# EAGLE schematic [Rev0.1] Avionics (EAGLE 8.3.2)

## Sheet 1 of 6: GPS MODULE
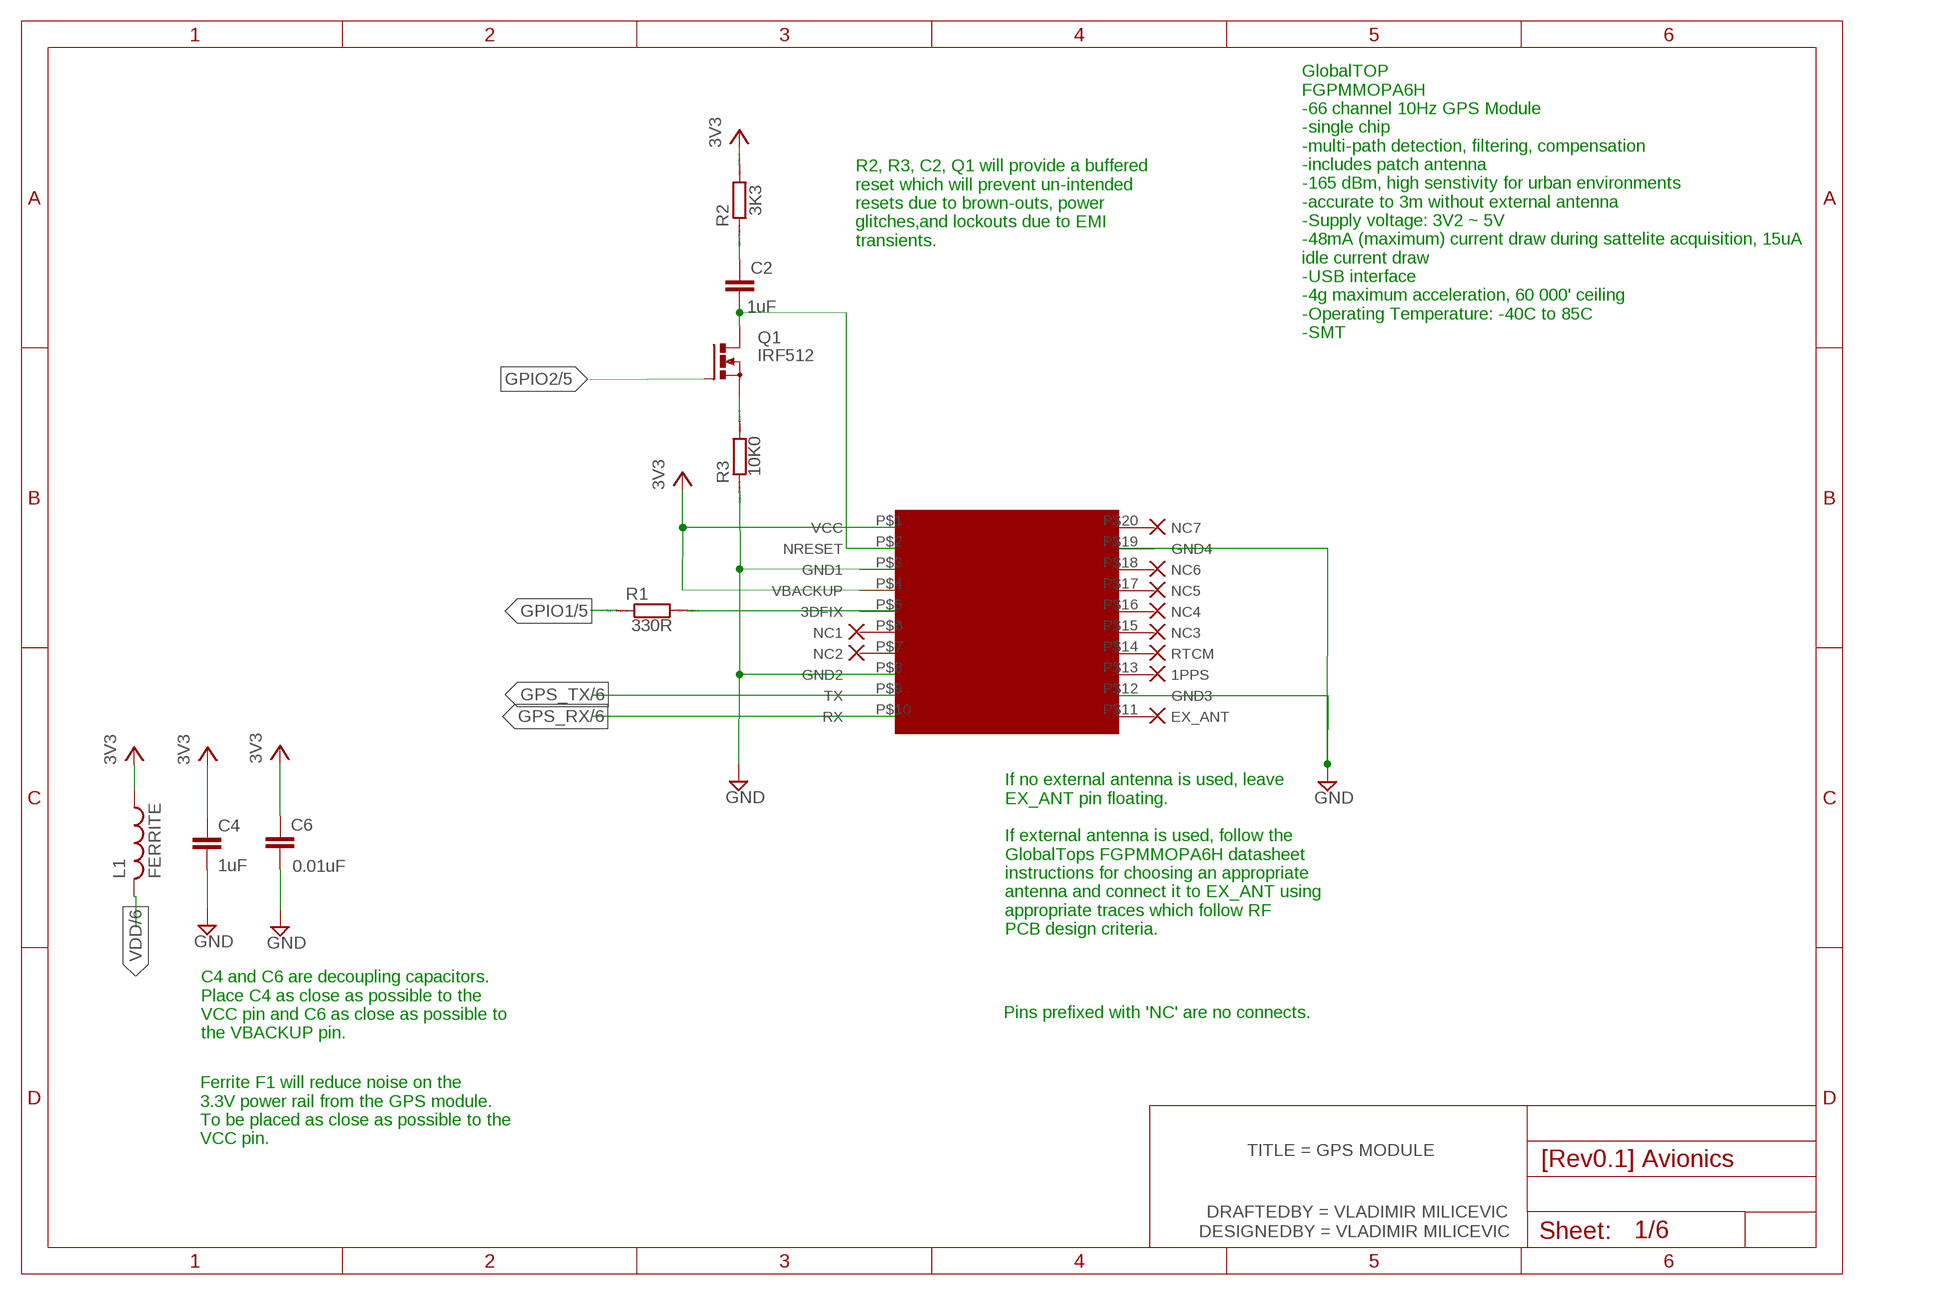
[diagram p0: schematic, sheet 1]
FRAME1 (A4L-LOC): DESIGNEDBY: VLADIMIR MILICEVIC; DRAFTEDBY: VLADIMIR MILICEVIC; TITLE: GPS MODULE

### Parts
C2  C2.5/2  [C2.5-2]
C4  C2.5/2  [C2.5-2]
C6  C2.5/2  [C2.5-2]
L1  FERRITE  L-USTFI0510  [TFI0510]
Q1  IRF512  [TO220BV]
R1  RR0603  [R0603]
R2  RR0402  [R0402]
R3  RR0402  [R0402]
U$1  GLOBALTOP-FPGMMOPAGHSMD_DIP20  [GLOBALTOP-FGPMMOPAGH]

### Nets
GND: C4.2 C6.2 U$1.P$8(GND2) U$1.P$12(GND3) U$1.P$19(GND4) ; also sheet 3,4,5,6
GPIO1: R1.1 ; also sheet 5,6
GPIO2: Q1.G ; also sheet 5,6
GPS_RX: U$1.P$10(RX) ; also sheet 6
GPS_TX: U$1.P$9(TX) ; also sheet 6
N$1: R1.2 U$1.P$5(3DFIX)
N$2: U$1.P$3(GND1)
N$3: Q1.S R3.2
N$4: R3.1
N$5: C2.2 Q1.D U$1.P$2(NRESET)
N$6: C2.1 R2.1
VCC: C4.1 C6.1 L1.1 R2.2 U$1.P$1(VCC) U$1.P$4(VBACKUP) ; supply symbol labelled 3V3 ; also sheet 3,4,5,6
VDD: L1.2 ; also sheet 5,6
Unconnected: U$1.P$6(NC1) U$1.P$7(NC2) U$1.P$11(EX_ANT) U$1.P$13(1PPS) U$1.P$14(RTCM) U$1.P$15(NC3) U$1.P$16(NC4) U$1.P$17(NC5) U$1.P$18(NC6) U$1.P$20(NC7)

### Notes on the sheet
- R2, R3, C2, Q1 will provide a buffered
  reset which will prevent un-intended
  resets due to brown-outs, power
  glitches,and lockouts due to EMI
  transients.
- GlobalTOP 
  FGPMMOPA6H
  -66 channel 10Hz GPS Module
  -single chip
  -multi-path detection, filtering, compensation
  -includes patch antenna 
  -165 dBm, high senstivity for urban environments
  -accurate to 3m without external antenna
  -Supply voltage: 3V2 ~ 5V
  -48mA (maximum) current draw during sattelite acquisition, 15uA 
  idle current draw
  -USB interface
  -4g maximum acceleration, 60 000' ceiling
  -Operating Temperature: -40C to 85C 
  -SMT
- If no external antenna is used, leave
  EX_ANT pin floating.
  
  If external antenna is used, follow the
  GlobalTops FGPMMOPA6H datasheet
  instructions for choosing an appropriate
  antenna and connect it to EX_ANT using
  appropriate traces which follow RF
  PCB design criteria.
- Pins prefixed with 'NC' are no connects.
- C4 and C6 are decoupling capacitors.
  Place C4 as close as possible to the
  VCC pin and C6 as close as possible to
  the VBACKUP pin.
- Ferrite F1 will reduce noise on the 
  3.3V power rail from the GPS module.
  To be placed as close as possible to the 
  VCC pin.

## Sheet 2 of 6: INPUT POWER REGULATION
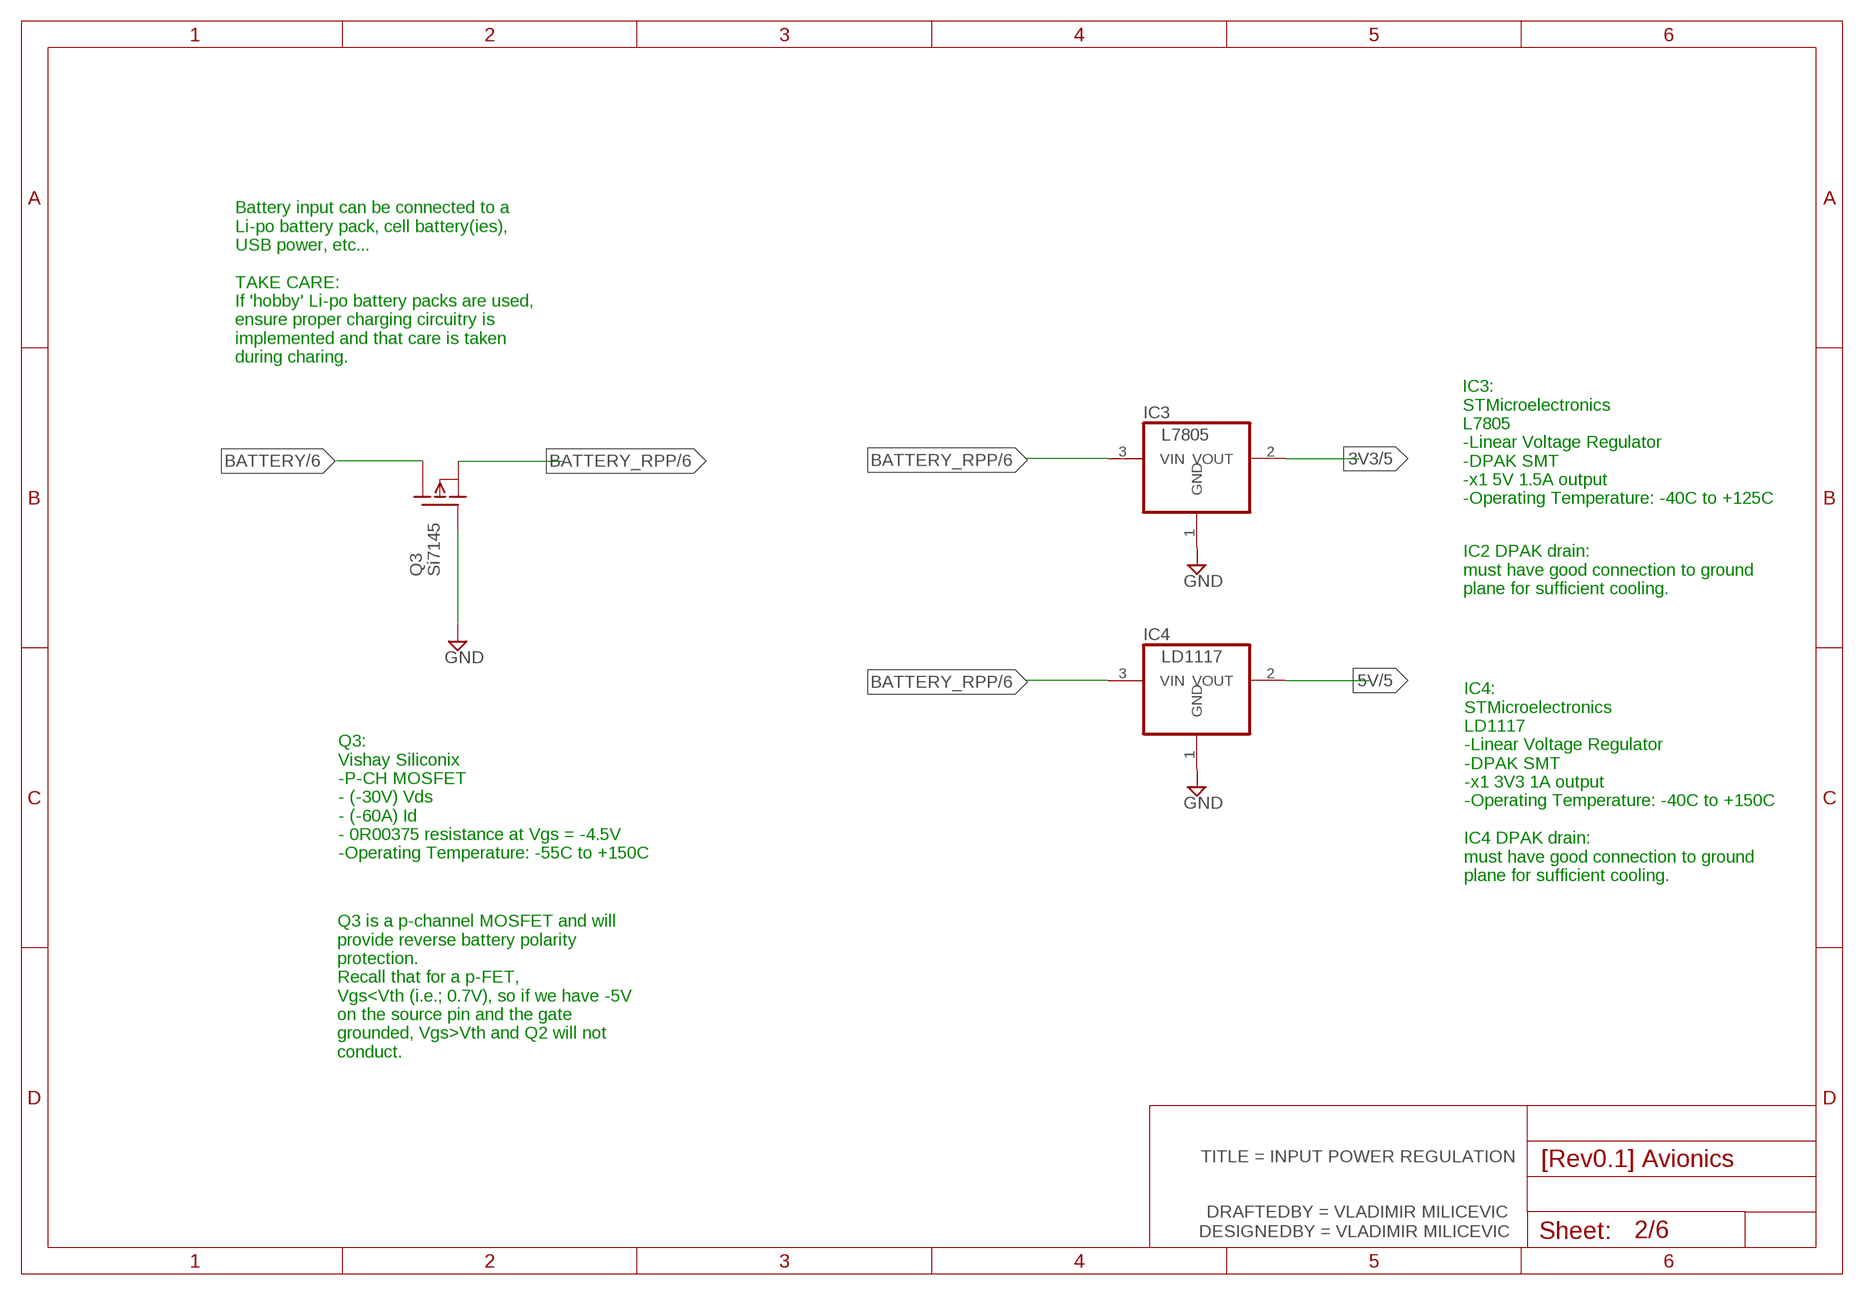
[diagram p1: schematic, sheet 2]
FRAME2 (A4L-LOC): DESIGNEDBY: VLADIMIR MILICEVIC; DRAFTEDBY: VLADIMIR MILICEVIC; TITLE: INPUT POWER REGULATION

### Parts
IC3  L7805  REG1117F  [DD-3]
IC4  LD1117  REG1117F  [DD-3]
Q3  Si7145  IRFD9210  [DIL04]

### Nets
3V3: IC3.2(VOUT) ; also sheet 5,6
5V: IC4.2(VOUT) ; also sheet 5,6
BATTERY: Q3.3(D) Q3.4(D) ; also sheet 6
BATTERY_RPP: IC3.3(VIN) IC4.3(VIN) Q3.2(S) ; also sheet 6
N$25: Q3.1(G)

### Notes on the sheet
- Battery input can be connected to a 
  Li-po battery pack, cell battery(ies),
  USB power, etc... 
  
  TAKE CARE:
  If 'hobby' Li-po battery packs are used,
  ensure proper charging circuitry is 
  implemented and that care is taken 
  during charing.
- IC3:
  STMicroelectronics
  L7805
  -Linear Voltage Regulator
  -DPAK SMT
  -x1 5V 1.5A output
  -Operating Temperature: -40C to +125C
- IC2 DPAK drain: 
  must have good connection to ground
  plane for sufficient cooling.
- IC4:
  STMicroelectronics
  LD1117
  -Linear Voltage Regulator
  -DPAK SMT
  -x1 3V3 1A output
  -Operating Temperature: -40C to +150C
- Q3:
  Vishay Siliconix
  -P-CH MOSFET
  - (-30V) Vds
  - (-60A) Id
  - 0R00375 resistance at Vgs = -4.5V
  -Operating Temperature: -55C to +150C
- IC4 DPAK drain:
  must have good connection to ground
  plane for sufficient cooling.
- Q3 is a p-channel MOSFET and will
  provide reverse battery polarity 
  protection. 
  Recall that for a p-FET, 
  Vgs<Vth (i.e.; 0.7V), so if we have -5V 
  on the source pin and the gate
  grounded, Vgs>Vth and Q2 will not 
  conduct.

## Sheet 3 of 6: ACCELEROMETER
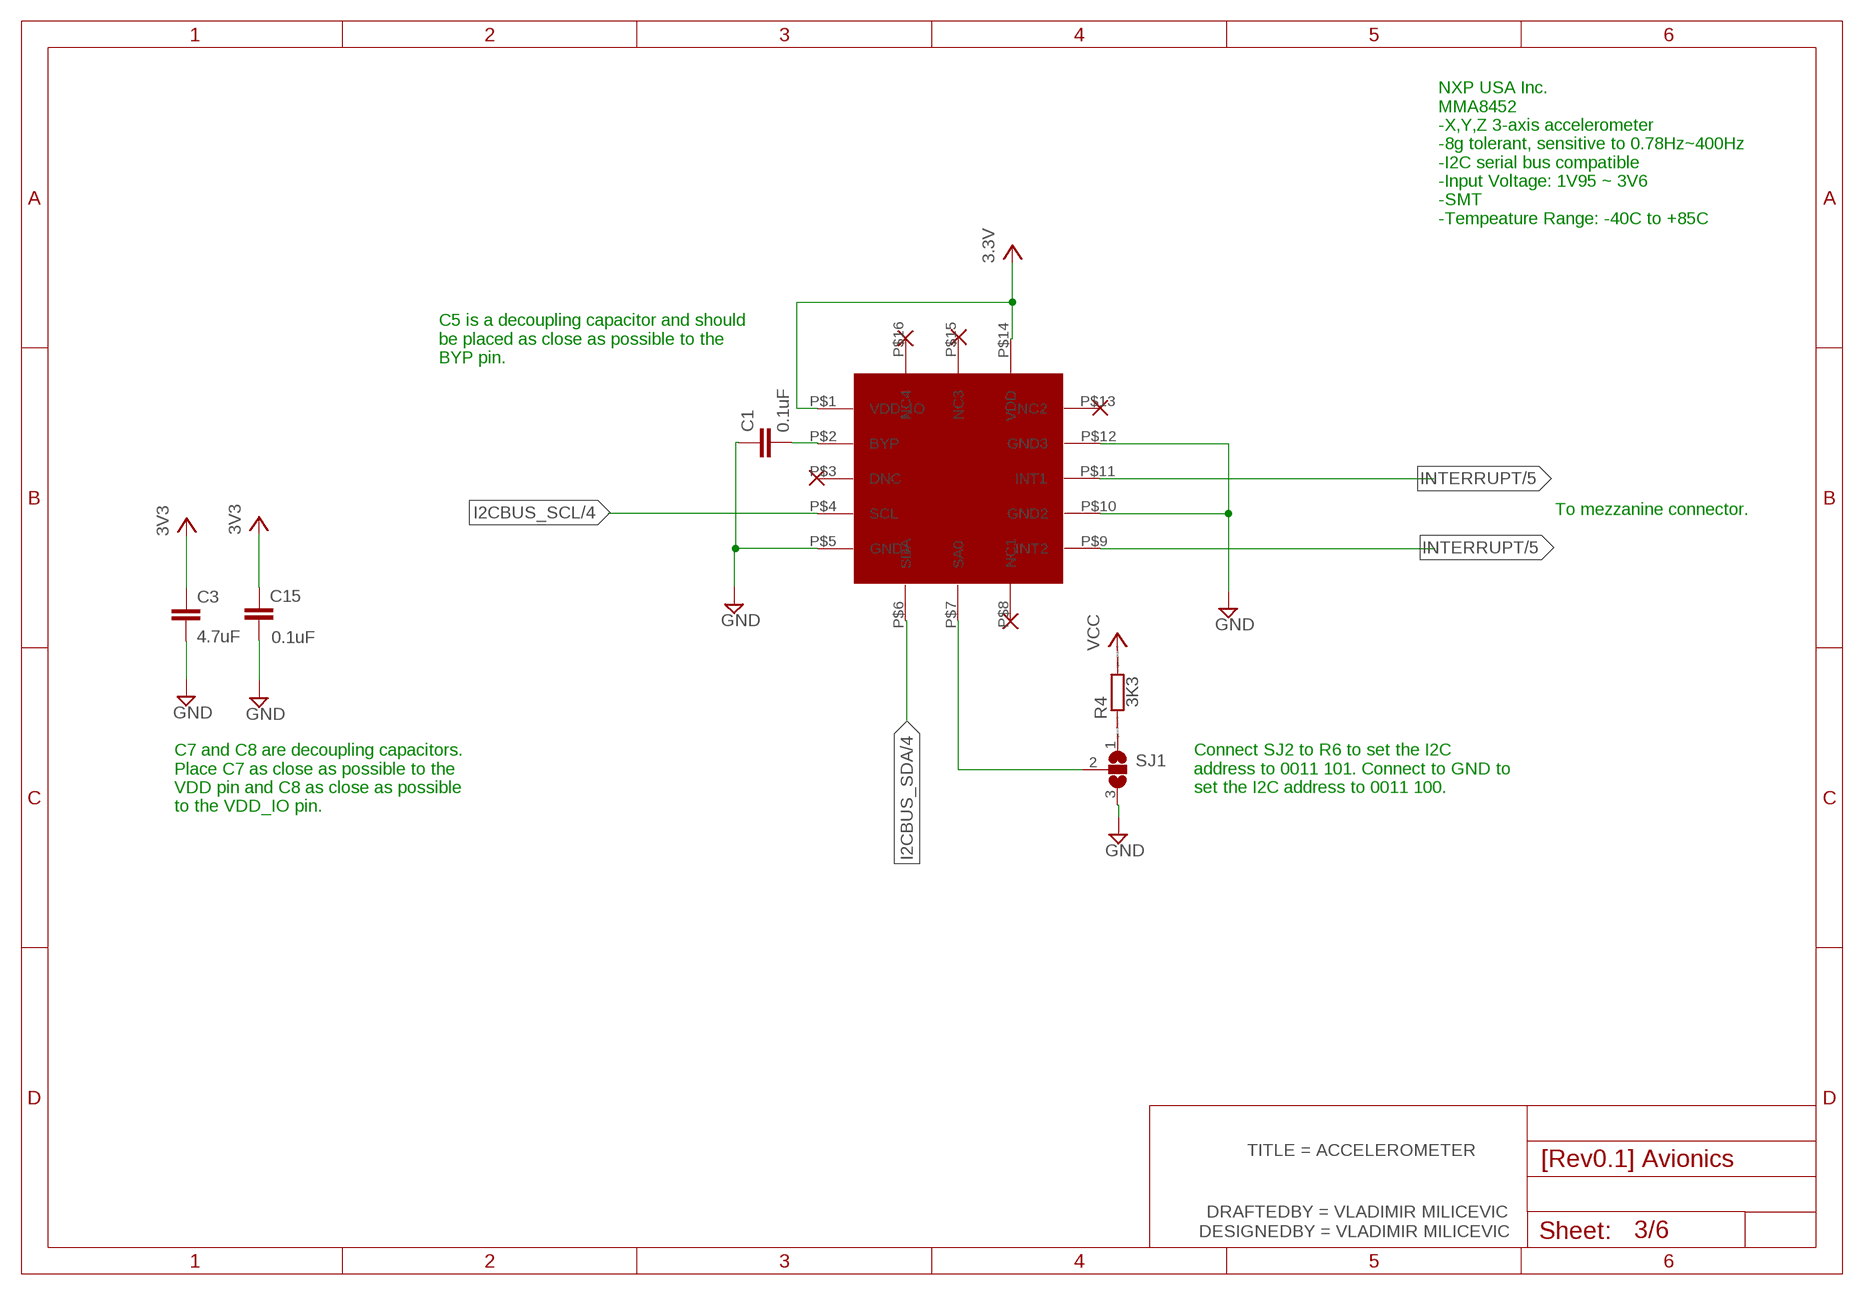
[diagram p2: schematic, sheet 3]
FRAME3 (A4L-LOC): DESIGNEDBY: VLADIMIR MILICEVIC; DRAFTEDBY: VLADIMIR MILICEVIC; TITLE: ACCELEROMETER

### Parts
C1  C2.5/4  [C2.5-4]
C3  C2.5/2  [C2.5-2]
C15  C2.5/2  [C2.5-2]
R4  RR0402  [R0402]
SJ1  SJ2WW  [SJ_2W]
U$2  MMA8452QQFN-16  [MMA8452Q]

### Nets
GND: C1.1 C3.2 C15.2 SJ1.3 U$2.P$5(GND1) U$2.P$10(GND2) U$2.P$12(GND3) ; also sheet 1,4,5,6
I2CBUS_SCL: U$2.P$4(SCL) ; also sheet 4,5,6
I2CBUS_SDA: U$2.P$6(SDA) ; also sheet 4,5,6
INTERRUPT: U$2.P$9(INT2) U$2.P$11(INT1) ; also sheet 5,6
N$7: C1.2 U$2.P$2(BYP)
N$8: SJ1.2 U$2.P$7(SA0)
VCC: C3.1 C15.1 U$2.P$1(VDD_IO) U$2.P$14(VDD) ; supply symbol labelled 3.3V, 3V3 ; also sheet 1,4,5,6
Unconnected: R4.1 R4.2 SJ1.1 U$2.P$3(DNC) U$2.P$8(NC1) U$2.P$13(NC2) U$2.P$15(NC3) U$2.P$16(NC4)

### Notes on the sheet
- NXP USA Inc. 
  MMA8452
  -X,Y,Z 3-axis accelerometer
  -8g tolerant, sensitive to 0.78Hz~400Hz
  -I2C serial bus compatible
  -Input Voltage: 1V95 ~ 3V6
  -SMT
  -Tempeature Range: -40C to +85C
- C5 is a decoupling capacitor and should
  be placed as close as possible to the 
  BYP pin.
- To mezzanine connector.
- Connect SJ2 to R6 to set the I2C
  address to 0011 101. Connect to GND to
  set the I2C address to 0011 100.
- C7 and C8 are decoupling capacitors.
  Place C7 as close as possible to the
  VDD pin and C8 as close as possible
  to the VDD_IO pin.

## Sheet 4 of 6: BAROMETER
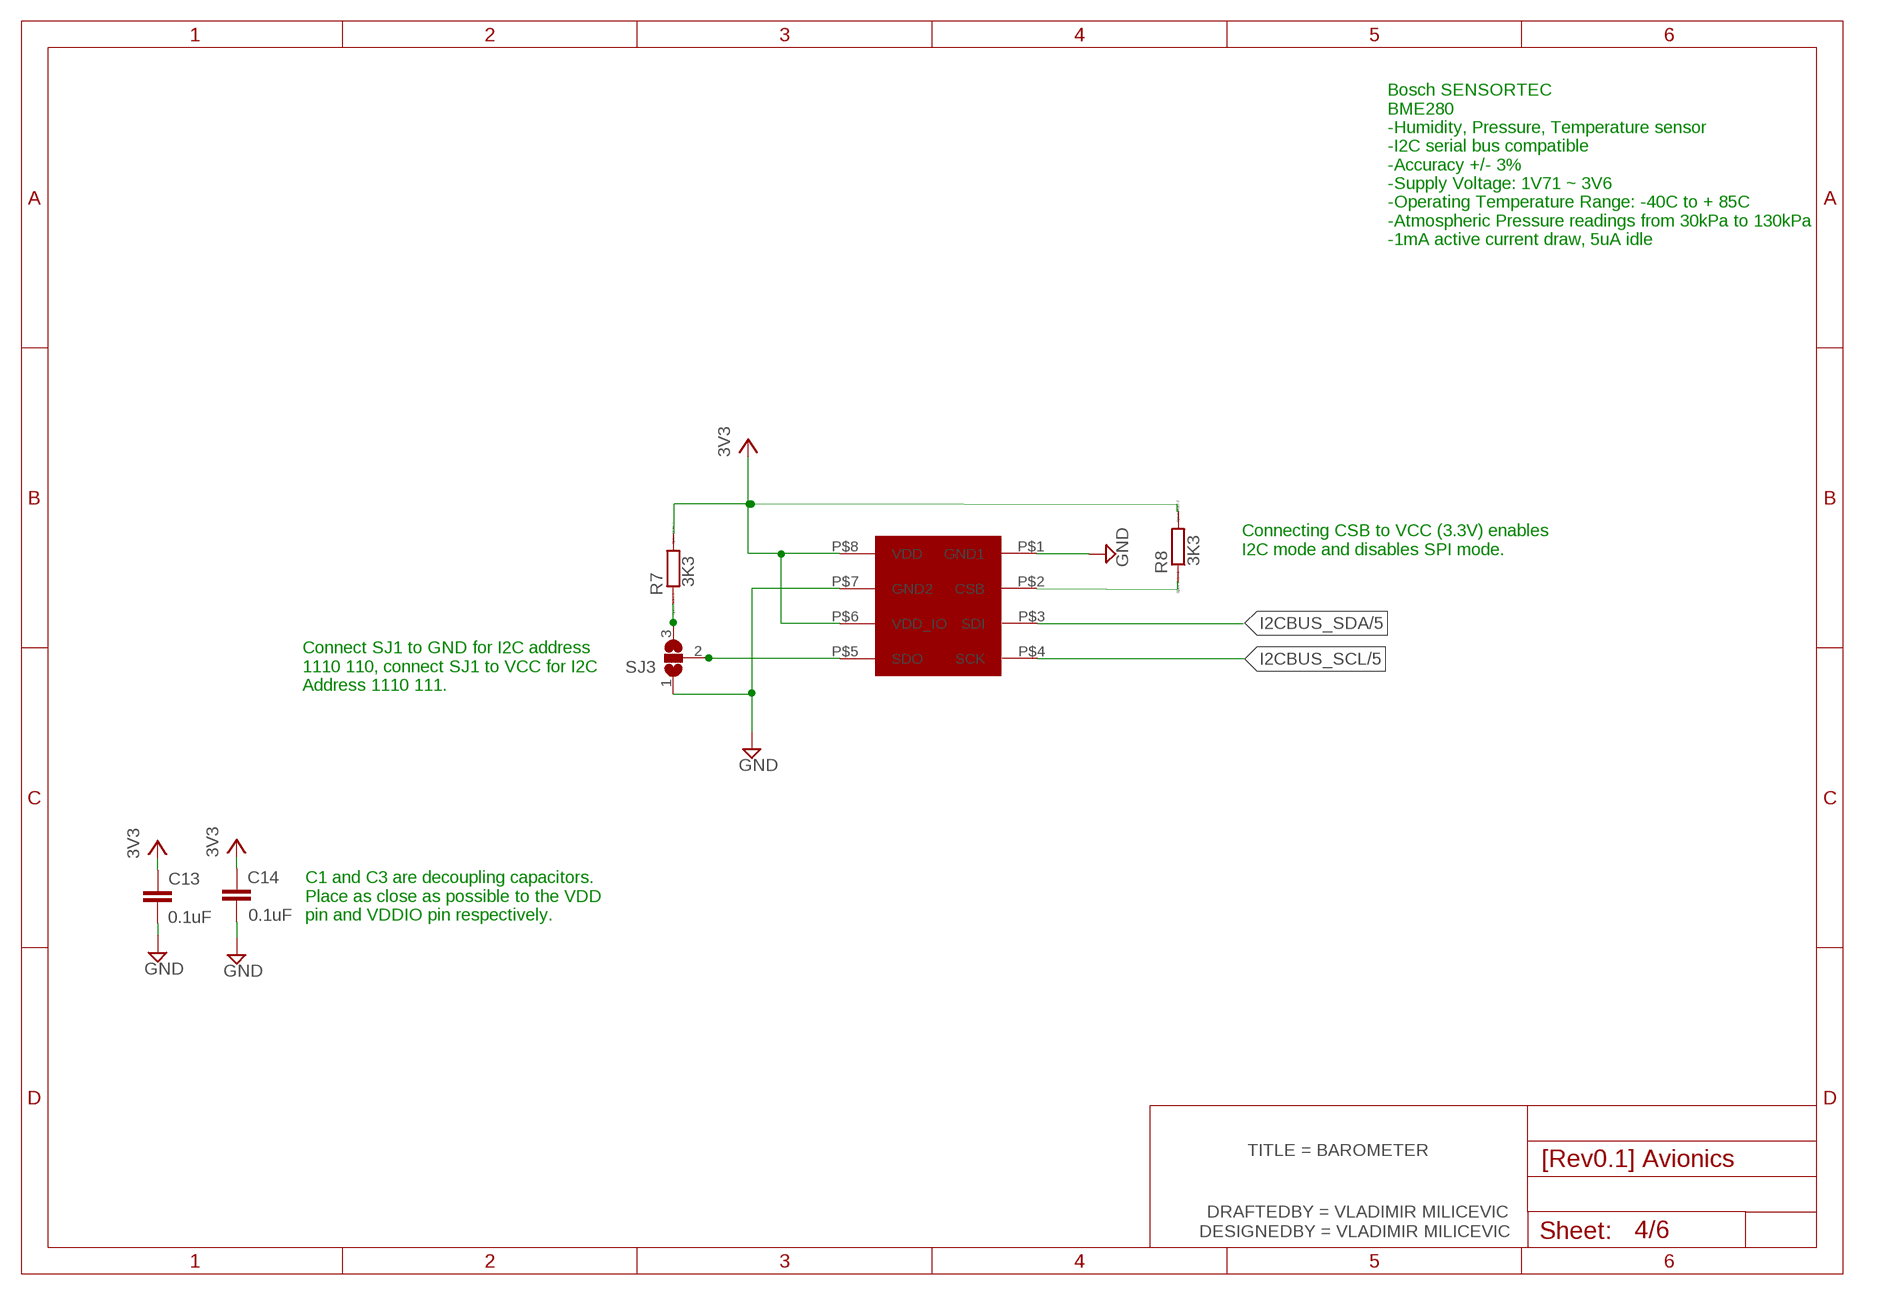
[diagram p3: schematic, sheet 4]
FRAME4 (A4L-LOC): DESIGNEDBY: VLADIMIR MILICEVIC; DRAFTEDBY: VLADIMIR MILICEVIC; TITLE: BAROMETER

### Parts
C13  C2.5/4  [C2.5-4]
C14  C2.5/4  [C2.5-4]
R7  RR0402  [R0402]
R8  RR0402  [R0402]
SJ3  SJ2WW  [SJ_2W]
U$5  BME280DIP-8  [BME280]

### Nets
GND: C13.2 C14.2 SJ3.1 U$5.P$1(GND1) U$5.P$7(GND2) ; also sheet 1,3,5,6
I2CBUS_SCL: U$5.P$4(SCK) ; also sheet 3,5,6
I2CBUS_SDA: U$5.P$3(SDI) ; also sheet 3,5,6
N$19: R7.2
N$30: SJ3.2 U$5.P$5(SDO)
N$31: R7.1 SJ3.3
N$32: U$5.P$6(VDD_IO)
N$33: U$5.P$2(CSB)
N$34: R8.1
N$35: R8.2
VCC: C13.1 C14.1 U$5.P$8(VDD) ; supply symbol labelled 3V3 ; also sheet 1,3,5,6

### Notes on the sheet
- Bosch SENSORTEC
  BME280
  -Humidity, Pressure, Temperature sensor
  -I2C serial bus compatible
  -Accuracy +/- 3%
  -Supply Voltage: 1V71 ~ 3V6
  -Operating Temperature Range: -40C to + 85C
  -Atmospheric Pressure readings from 30kPa to 130kPa
  -1mA active current draw, 5uA idle
- Connecting CSB to VCC (3.3V) enables
  I2C mode and disables SPI mode.
- Connect SJ1 to GND for I2C address
  1110 110, connect SJ1 to VCC for I2C
  Address 1110 111.
- C1 and C3 are decoupling capacitors.
  Place as close as possible to the VDD
  pin and VDDIO pin respectively.

## Sheet 5 of 6: MICROCONTROLLER
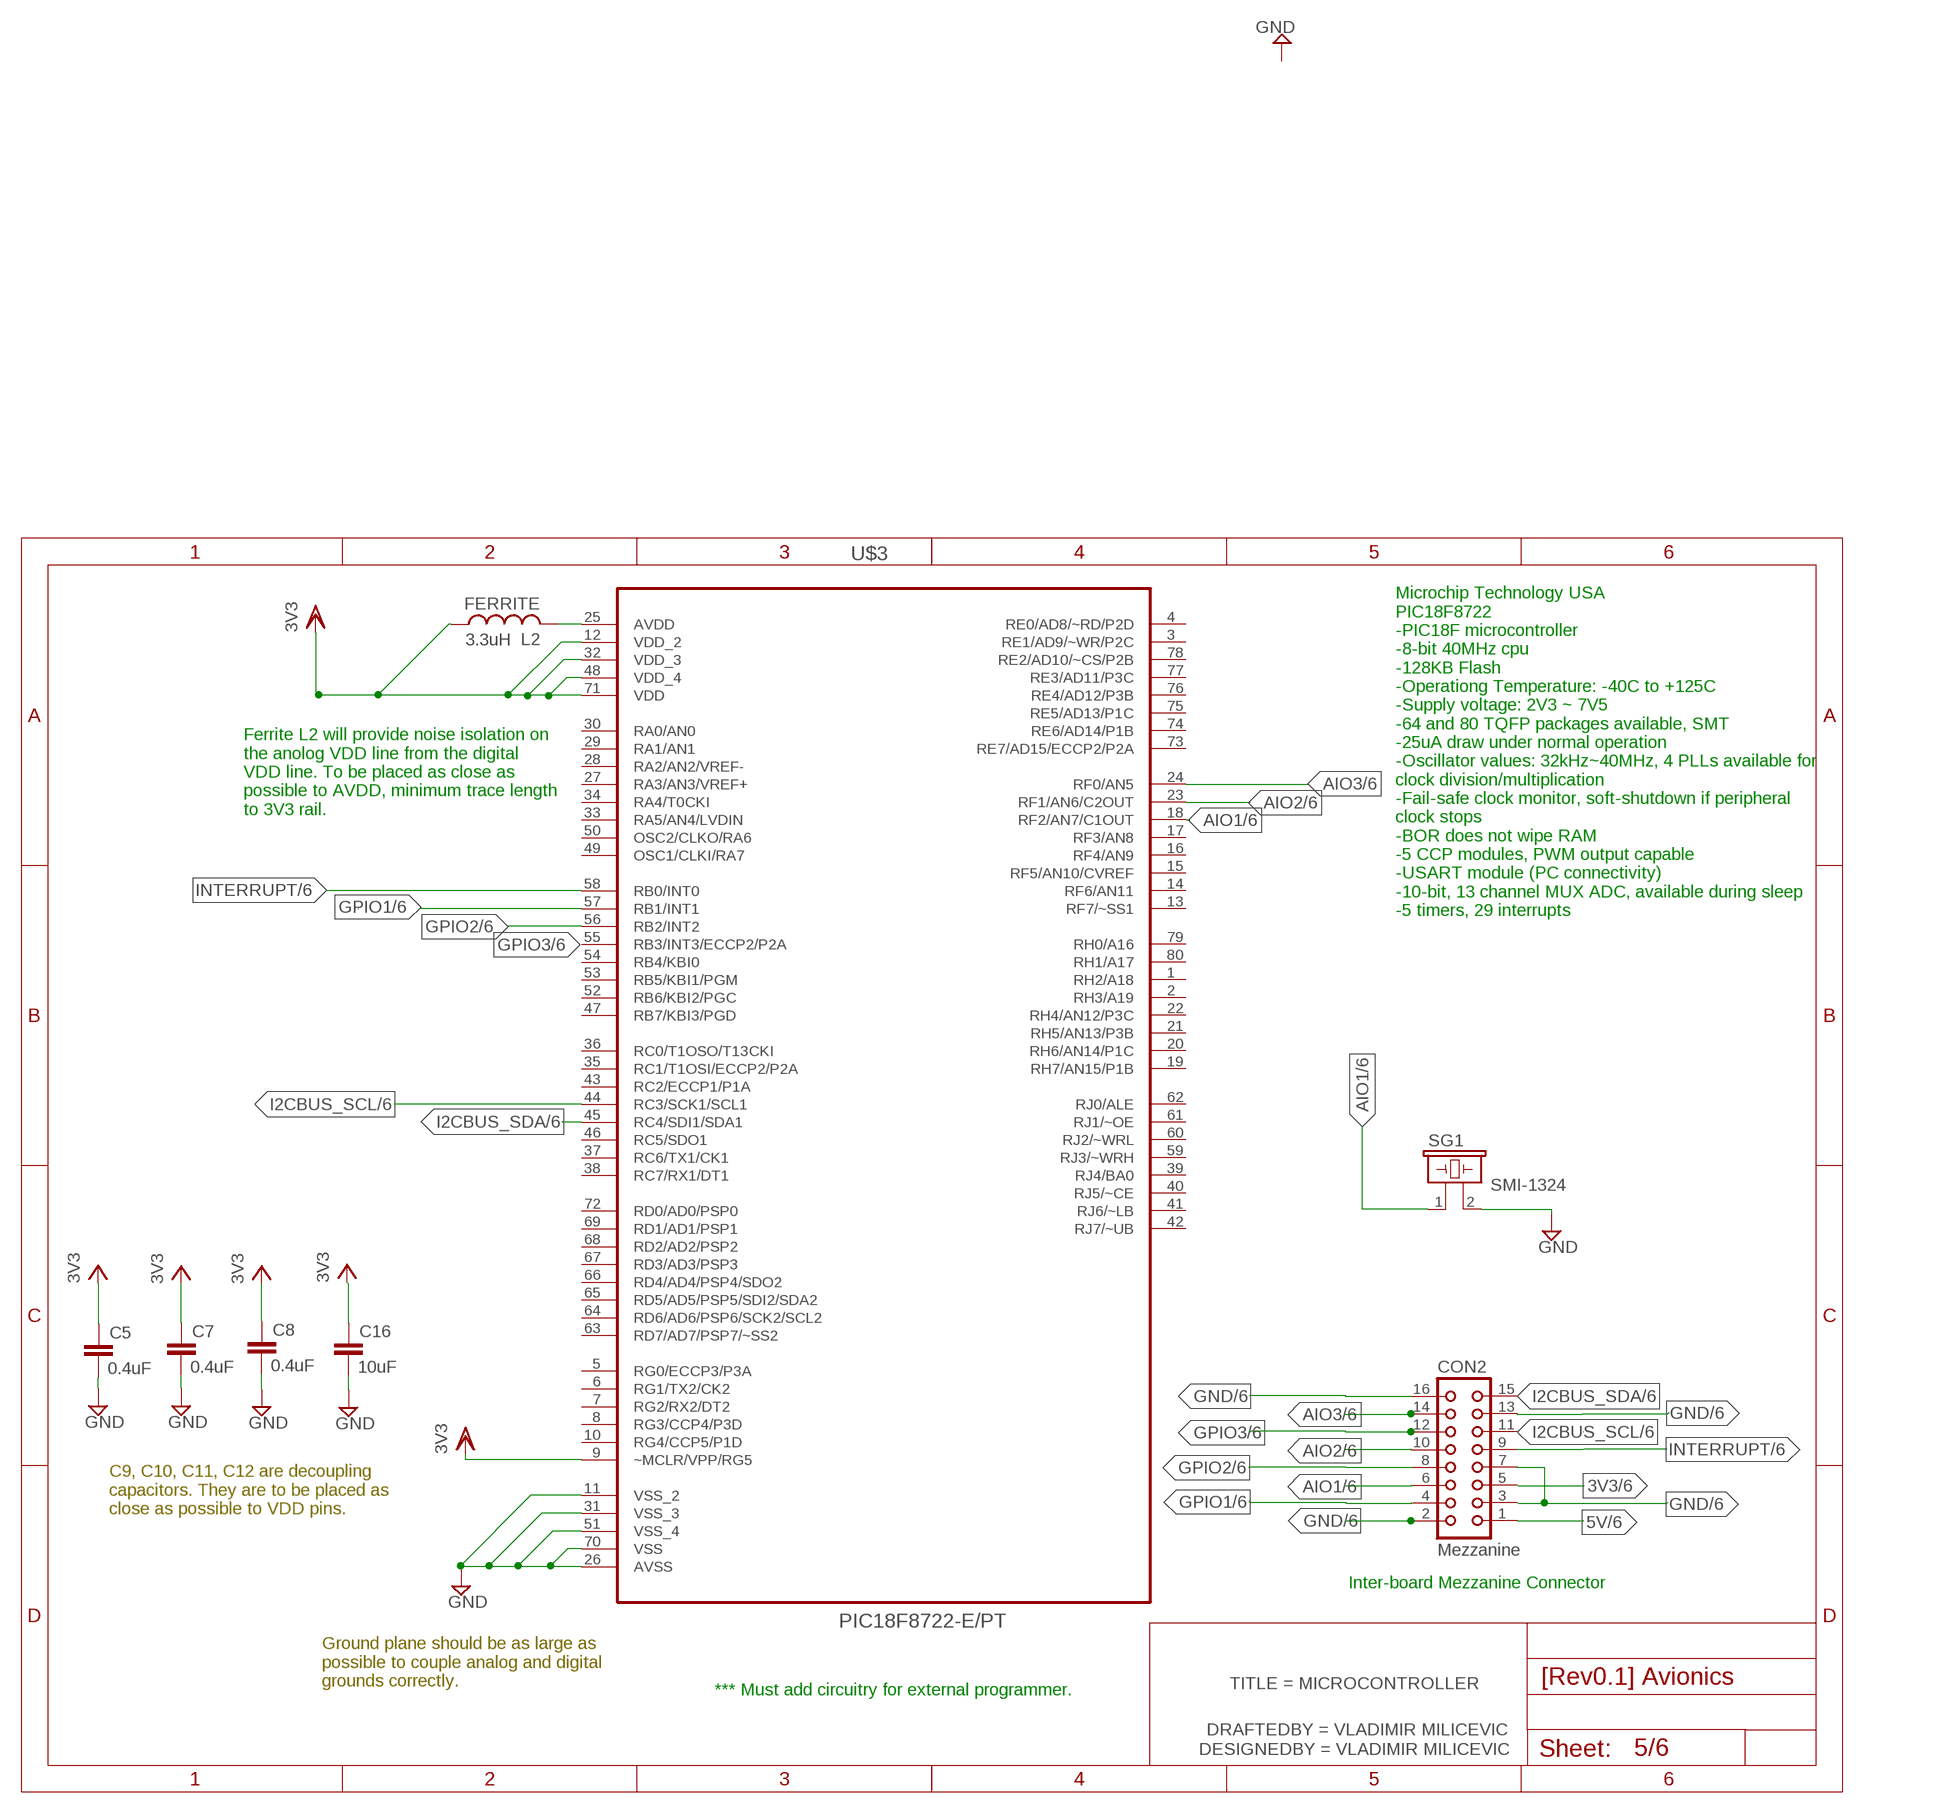
[diagram p4: schematic, sheet 5]
FRAME6 (A4L-LOC): DESIGNEDBY: VLADIMIR MILICEVIC; DRAFTEDBY: VLADIMIR MILICEVIC; TITLE: MICROCONTROLLER

### Parts
C5  C2,5-3  [C2.5-3]
C7  C2,5-3  [C2.5-3]
C8  C2,5-3  [C2.5-3]
C16  C2,5-3  [C2.5-3]
CON2  Mezzanine  CON16  [CON16]
L2  FERRITE  L-US0204/5  [0204/5]
SG1  SMI-1324  F/EE17P  [F/EE17P]
U$3  PIC18F8722-E/PT  [QFP50P1400X1400X120-80N]

### Nets
5V: CON2.1 ; also sheet 2,6
AIO1: SG1.1 U$3.18(RF2/AN7/C1OUT) ; also sheet 6
AIO2: U$3.23(RF1/AN6/C2OUT) ; also sheet 6
AIO3: CON2.14 U$3.24(RF0/AN5) ; also sheet 6
GND: C5.2 C7.2 C8.2 C16.2 CON2.2 SG1.2 U$3.26(AVSS) ; also sheet 1,3,4,6
GPIO3: CON2.12 ; also sheet 6
INTERRUPT: U$3.58(RB0/INT0) ; also sheet 3,6
N$10: U$3.48(VDD_4)
N$11: U$3.32(VDD_3)
N$13: CON2.7
N$17: U$3.12(VDD_2)
N$18: L2.2 U$3.25(AVDD)
N$20: L2.1
N$22: U$3.70(VSS)
N$23: U$3.51(VSS_4)
N$24: U$3.31(VSS_3)
N$26: U$3.11(VSS_2)
N$27: U$3.44(RC3/SCK1/SCL1)
N$28: U$3.45(RC4/SDI1/SDA1)
N$37: U$3.56(RB2/INT2)
N$38: U$3.57(RB1/INT1)
VCC: C5.1 C7.1 C8.1 C16.1 ; supply symbol labelled 3V3 ; also sheet 1,3,4,6
VDD: U$3.9(~MCLR/VPP/RG5) U$3.71(VDD) ; supply symbol labelled 3V3 ; also sheet 1,6
Unconnected: CON2.3 CON2.4 CON2.5 CON2.6 CON2.8 CON2.9 CON2.10 CON2.11 CON2.13 CON2.15 CON2.16 U$3.1(RH2/A18) U$3.2(RH3/A19) U$3.3(RE1/AD9/~WR/P2C) U$3.4(RE0/AD8/~RD/P2D) U$3.5(RG0/ECCP3/P3A) U$3.6(RG1/TX2/CK2) U$3.7(RG2/RX2/DT2) U$3.8(RG3/CCP4/P3D) U$3.10(RG4/CCP5/P1D) U$3.13(RF7/~SS1) U$3.14(RF6/AN11) U$3.15(RF5/AN10/CVREF) U$3.16(RF4/AN9) U$3.17(RF3/AN8) U$3.19(RH7/AN15/P1B) U$3.20(RH6/AN14/P1C) U$3.21(RH5/AN13/P3B) U$3.22(RH4/AN12/P3C) U$3.27(RA3/AN3/VREF+) U$3.28(RA2/AN2/VREF-) U$3.29(RA1/AN1) U$3.30(RA0/AN0) U$3.33(RA5/AN4/LVDIN) U$3.34(RA4/T0CKI) U$3.35(RC1/T1OSI/ECCP2/P2A) U$3.36(RC0/T1OSO/T13CKI) U$3.37(RC6/TX1/CK1) U$3.38(RC7/RX1/DT1) U$3.39(RJ4/BA0) U$3.40(RJ5/~CE) U$3.41(RJ6/~LB) U$3.42(RJ7/~UB) U$3.43(RC2/ECCP1/P1A) U$3.46(RC5/SDO1) U$3.47(RB7/KBI3/PGD) U$3.49(OSC1/CLKI/RA7) U$3.50(OSC2/CLKO/RA6) U$3.52(RB6/KBI2/PGC) U$3.53(RB5/KBI1/PGM) U$3.54(RB4/KBI0) U$3.55(RB3/INT3/ECCP2/P2A) U$3.59(RJ3/~WRH) U$3.60(RJ2/~WRL) U$3.61(RJ1/~OE) U$3.62(RJ0/ALE) U$3.63(RD7/AD7/PSP7/~SS2) U$3.64(RD6/AD6/PSP6/SCK2/SCL2) U$3.65(RD5/AD5/PSP5/SDI2/SDA2) U$3.66(RD4/AD4/PSP4/SDO2) U$3.67(RD3/AD3/PSP3) U$3.68(RD2/AD2/PSP2) U$3.69(RD1/AD1/PSP1) U$3.72(RD0/AD0/PSP0) U$3.73(RE7/AD15/ECCP2/P2A) U$3.74(RE6/AD14/P1B) U$3.75(RE5/AD13/P1C) U$3.76(RE4/AD12/P3B) U$3.77(RE3/AD11/P3C) U$3.78(RE2/AD10/~CS/P2B) U$3.79(RH0/A16) U$3.80(RH1/A17)

### Notes on the sheet
- Ferrite L2 will provide noise isolation on 
  the anolog VDD line from the digital 
  VDD line. To be placed as close as 
  possible to AVDD, minimum trace length
  to 3V3 rail.
- Microchip Technology USA
  PIC18F8722
  -PIC18F microcontroller
  -8-bit 40MHz cpu
  -128KB Flash 
  -Operationg Temperature: -40C to +125C 
  -Supply voltage: 2V3 ~ 7V5
  -64 and 80 TQFP packages available, SMT
  -25uA draw under normal operation
  -Oscillator values: 32kHz~40MHz, 4 PLLs available for 
  clock division/multiplication
  -Fail-safe clock monitor, soft-shutdown if peripheral 
  clock stops
  -BOR does not wipe RAM
  -5 CCP modules, PWM output capable
  -USART module (PC connectivity)
  -10-bit, 13 channel MUX ADC, available during sleep
  -5 timers, 29 interrupts
- C9, C10, C11, C12 are decoupling
  capacitors. They are to be placed as 
  close as possible to VDD pins.
- Inter-board Mezzanine Connector
- Ground plane should be as large as 
  possible to couple analog and digital 
  grounds correctly.
- *** Must add circuitry for external programmer.

## Sheet 6 of 6: Overall
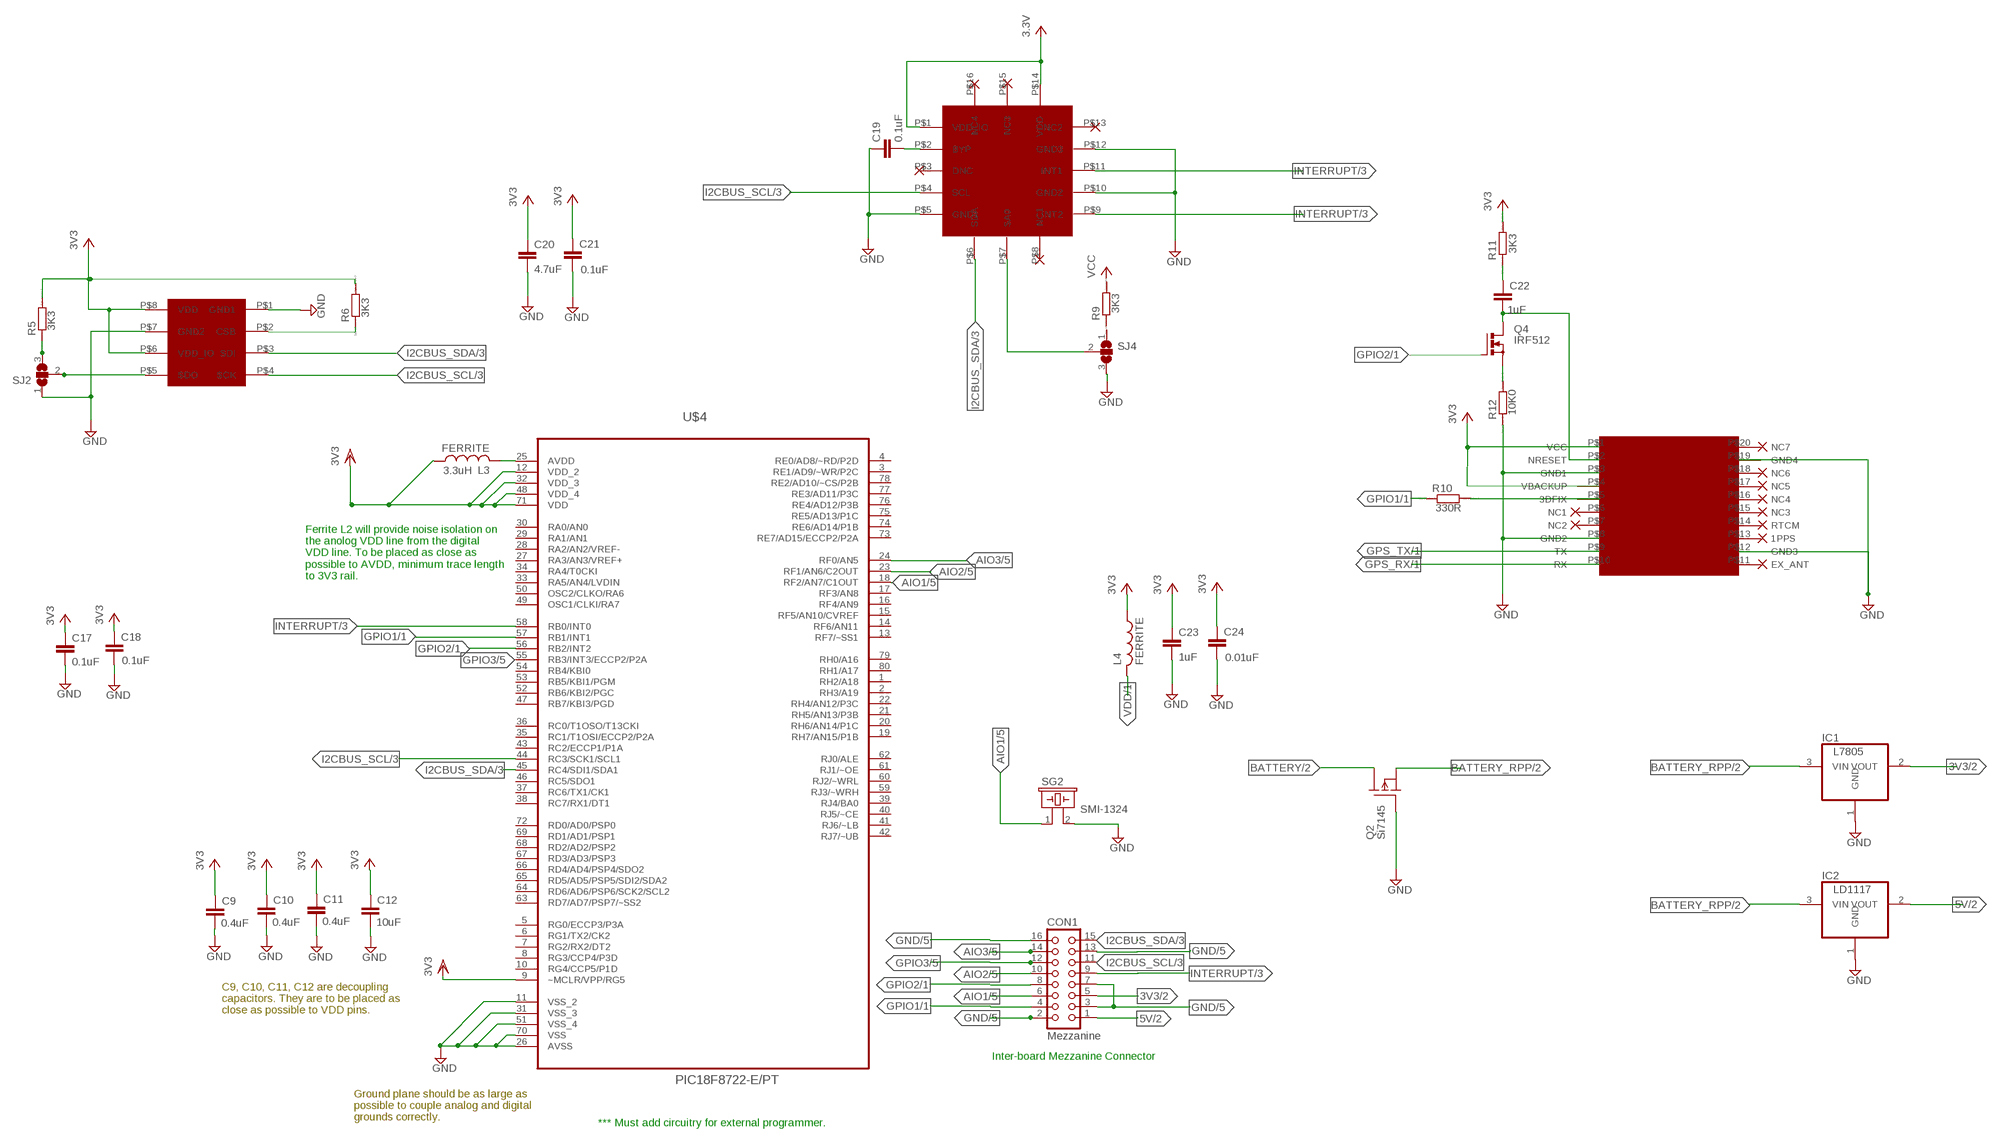
[diagram p5: schematic, sheet 6]

### Parts
C9  C2,5-3  [C2.5-3]
C10  C2,5-3  [C2.5-3]
C11  C2,5-3  [C2.5-3]
C12  C2,5-3  [C2.5-3]
C17  C2.5/4  [C2.5-4]
C18  C2.5/4  [C2.5-4]
C19  C2.5/4  [C2.5-4]
C20  C2.5/2  [C2.5-2]
C21  C2.5/2  [C2.5-2]
C22  C2.5/2  [C2.5-2]
C23  C2.5/2  [C2.5-2]
C24  C2.5/2  [C2.5-2]
CON1  Mezzanine  CON16  [CON16]
IC1  L7805  REG1117F  [DD-3]
IC2  LD1117  REG1117F  [DD-3]
L3  FERRITE  L-US0204/5  [0204/5]
L4  FERRITE  L-USTFI0510  [TFI0510]
Q2  Si7145  IRFD9210  [DIL04]
Q4  IRF512  [TO220BV]
R5  RR0402  [R0402]
R6  RR0402  [R0402]
R9  RR0402  [R0402]
R10  RR0603  [R0603]
R11  RR0402  [R0402]
R12  RR0402  [R0402]
SG2  SMI-1324  F/EE17P  [F/EE17P]
SJ2  SJ2WW  [SJ_2W]
SJ4  SJ2WW  [SJ_2W]
U$4  PIC18F8722-E/PT  [QFP50P1400X1400X120-80N]
U$6  BME280DIP-8  [BME280]
U$7  MMA8452QQFN-16  [MMA8452Q]
U$8  GLOBALTOP-FPGMMOPAGHSMD_DIP20  [GLOBALTOP-FGPMMOPAGH]

### Nets
3V3: IC1.2(VOUT) ; also sheet 2,5
5V: CON1.1 IC2.2(VOUT) ; also sheet 2,5
AIO1: SG2.1 U$4.18(RF2/AN7/C1OUT) ; also sheet 5
AIO2: U$4.23(RF1/AN6/C2OUT) ; also sheet 5
AIO3: CON1.14 U$4.24(RF0/AN5) ; also sheet 5
BATTERY: Q2.3(D) Q2.4(D) ; also sheet 2
BATTERY_RPP: IC1.3(VIN) IC2.3(VIN) Q2.2(S) ; also sheet 2
GND: C9.2 C10.2 C11.2 C12.2 C17.2 C18.2 C19.1 C20.2 C21.2 C23.2 C24.2 CON1.2 SG2.2 SJ2.1 SJ4.3 U$4.26(AVSS) U$6.P$1(GND1) U$6.P$7(GND2) U$7.P$5(GND1) U$7.P$10(GND2) U$7.P$12(GND3) U$8.P$8(GND2) U$8.P$12(GND3) U$8.P$19(GND4) ; also sheet 1,3,4,5
GPIO1: R10.1 ; also sheet 1,5
GPIO2: Q4.G ; also sheet 1,5
GPIO3: CON1.12 ; also sheet 5
GPS_RX: U$8.P$10(RX) ; also sheet 1
GPS_TX: U$8.P$9(TX) ; also sheet 1
I2CBUS_SCL: U$6.P$4(SCK) U$7.P$4(SCL) ; also sheet 3,4,5
I2CBUS_SDA: U$6.P$3(SDI) U$7.P$6(SDA) ; also sheet 3,4,5
INTERRUPT: U$4.58(RB0/INT0) U$7.P$9(INT2) U$7.P$11(INT1) ; also sheet 3,5
N$21: CON1.7
N$43: U$4.48(VDD_4)
N$44: U$4.32(VDD_3)
N$45: U$4.12(VDD_2)
N$46: L3.2 U$4.25(AVDD)
N$47: L3.1
N$48: U$4.70(VSS)
N$49: U$4.51(VSS_4)
N$50: U$4.31(VSS_3)
N$51: U$4.11(VSS_2)
N$52: U$4.44(RC3/SCK1/SCL1)
N$53: U$4.45(RC4/SDI1/SDA1)
N$54: U$4.56(RB2/INT2)
N$55: U$4.57(RB1/INT1)
N$56: R5.2
N$58: SJ2.2 U$6.P$5(SDO)
N$59: R5.1 SJ2.3
N$60: U$6.P$6(VDD_IO)
N$61: U$6.P$2(CSB)
N$62: R6.1
N$63: R6.2
N$64: C19.2 U$7.P$2(BYP)
N$65: SJ4.2 U$7.P$7(SA0)
N$66: Q2.1(G)
N$67: R10.2 U$8.P$5(3DFIX)
N$68: U$8.P$3(GND1)
N$69: Q4.S R12.2
N$70: R12.1
N$71: C22.2 Q4.D U$8.P$2(NRESET)
N$72: C22.1 R11.1
VCC: C9.1 C10.1 C11.1 C12.1 C17.1 C18.1 C20.1 C21.1 C23.1 C24.1 L4.1 R11.2 U$6.P$8(VDD) U$7.P$1(VDD_IO) U$7.P$14(VDD) U$8.P$1(VCC) U$8.P$4(VBACKUP) ; supply symbol labelled 3V3, 3.3V ; also sheet 1,3,4,5
VDD: L4.2 U$4.9(~MCLR/VPP/RG5) U$4.71(VDD) ; supply symbol labelled 3V3 ; also sheet 1,5
Unconnected: CON1.3 CON1.4 CON1.5 CON1.6 CON1.8 CON1.9 CON1.10 CON1.11 CON1.13 CON1.15 CON1.16 R9.1 R9.2 SJ4.1 U$4.1(RH2/A18) U$4.2(RH3/A19) U$4.3(RE1/AD9/~WR/P2C) U$4.4(RE0/AD8/~RD/P2D) U$4.5(RG0/ECCP3/P3A) U$4.6(RG1/TX2/CK2) U$4.7(RG2/RX2/DT2) U$4.8(RG3/CCP4/P3D) U$4.10(RG4/CCP5/P1D) U$4.13(RF7/~SS1) U$4.14(RF6/AN11) U$4.15(RF5/AN10/CVREF) U$4.16(RF4/AN9) U$4.17(RF3/AN8) U$4.19(RH7/AN15/P1B) U$4.20(RH6/AN14/P1C) U$4.21(RH5/AN13/P3B) U$4.22(RH4/AN12/P3C) U$4.27(RA3/AN3/VREF+) U$4.28(RA2/AN2/VREF-) U$4.29(RA1/AN1) U$4.30(RA0/AN0) U$4.33(RA5/AN4/LVDIN) U$4.34(RA4/T0CKI) U$4.35(RC1/T1OSI/ECCP2/P2A) U$4.36(RC0/T1OSO/T13CKI) U$4.37(RC6/TX1/CK1) U$4.38(RC7/RX1/DT1) U$4.39(RJ4/BA0) U$4.40(RJ5/~CE) U$4.41(RJ6/~LB) U$4.42(RJ7/~UB) U$4.43(RC2/ECCP1/P1A) U$4.46(RC5/SDO1) U$4.47(RB7/KBI3/PGD) U$4.49(OSC1/CLKI/RA7) U$4.50(OSC2/CLKO/RA6) U$4.52(RB6/KBI2/PGC) U$4.53(RB5/KBI1/PGM) U$4.54(RB4/KBI0) U$4.55(RB3/INT3/ECCP2/P2A) U$4.59(RJ3/~WRH) U$4.60(RJ2/~WRL) U$4.61(RJ1/~OE) U$4.62(RJ0/ALE) U$4.63(RD7/AD7/PSP7/~SS2) U$4.64(RD6/AD6/PSP6/SCK2/SCL2) U$4.65(RD5/AD5/PSP5/SDI2/SDA2) U$4.66(RD4/AD4/PSP4/SDO2) U$4.67(RD3/AD3/PSP3) U$4.68(RD2/AD2/PSP2) U$4.69(RD1/AD1/PSP1) U$4.72(RD0/AD0/PSP0) U$4.73(RE7/AD15/ECCP2/P2A) U$4.74(RE6/AD14/P1B) U$4.75(RE5/AD13/P1C) U$4.76(RE4/AD12/P3B) U$4.77(RE3/AD11/P3C) U$4.78(RE2/AD10/~CS/P2B) U$4.79(RH0/A16) U$4.80(RH1/A17) U$7.P$3(DNC) U$7.P$8(NC1) U$7.P$13(NC2) U$7.P$15(NC3) U$7.P$16(NC4) U$8.P$6(NC1) U$8.P$7(NC2) U$8.P$11(EX_ANT) U$8.P$13(1PPS) U$8.P$14(RTCM) U$8.P$15(NC3) U$8.P$16(NC4) U$8.P$17(NC5) U$8.P$18(NC6) U$8.P$20(NC7)

### Notes on the sheet
- Ferrite L2 will provide noise isolation on 
  the anolog VDD line from the digital 
  VDD line. To be placed as close as 
  possible to AVDD, minimum trace length
  to 3V3 rail.
- C9, C10, C11, C12 are decoupling
  capacitors. They are to be placed as 
  close as possible to VDD pins.
- Inter-board Mezzanine Connector
- Ground plane should be as large as 
  possible to couple analog and digital 
  grounds correctly.
- *** Must add circuitry for external programmer.

## Power pins joined to a net without a drawn wire
GND: IC1.1(GND) IC2.1(GND) IC3.1(GND) IC4.1(GND)

## Library data of the parts
C1 C13-C15 C17-C19 C21 = capacitor-wima:C: CAPACITOR naming: grid - package width; VAL: 0.1uF
C2 C4 C22 C23 = capacitor-wima:C: CAPACITOR naming: grid - package width; VAL: 1uF
C3 C20 = capacitor-wima:C: CAPACITOR naming: grid - package width; VAL: 4.7uF
C5 C7-C11 = capacitor-wima:C: CAPACITOR naming: grid - package width; VAL: 0.4uF
C6 C24 = capacitor-wima:C: CAPACITOR naming: grid - package width; VAL: 0.01uF
C12 C16 = capacitor-wima:C: CAPACITOR naming: grid - package width; VAL: 10uF
CON1 CON2 = con-harting:CON16: CONNECTOR; OC_FARNELL: unknown; OC_NEWARK: unknown
IC1-IC4 = burr-brown:REG1117: 800mA and 1A Low Dropout (LDO) Positive Regulator 1.8V, 2.5V, 2.85V, 3.3V, 5V, and Adj; MF: TEXAS INSTRUMENTS; MPN: REG1117FAKTTT; OC_FARNELL: 1296120; OC_NEWARK: 87H2562
L1 L4 = rcl:L-US: INDUCTOR, American symbol
L2 L3 = resistor:L-US: INDUCTOR, American symbol; VAL: 3.3uH
Q1 Q4 = transistor-power:IRF512: N-CHANNEL MOS FET
Q2 Q3 = transistor-fet:IRFD9210: P-Channel Enhancement MOSFET
R1 R10 = eagle-ltspice:R: RESISTOR, European symbol; SPICEMODEL: NONE; SPICEPREFIX: 330R
R2 R4-R9 R11 = eagle-ltspice:R: RESISTOR, European symbol; SPICEMODEL: NONE; SPICEPREFIX: 3K3
R3 R12 = eagle-ltspice:R: RESISTOR, European symbol; SPICEMODEL: NONE; SPICEPREFIX: 10K0
SG1 SG2 = buzzer:F/EE17P: BUZZER Source: Buerklin; OC_FARNELL: unknown; OC_NEWARK: unknown
SJ1-SJ4 = jumper:SJ2W: SMD solder JUMPER
U$1 U$8 = GLOBALTOP FGPMMOPAGH:GLOBALTOP-FPGMMOPAGH
U$2 U$7 = MMA8452Q:MMA8452Q
U$3 U$4 = Microchip_By_element14_Batch_1:PIC18F8722-E/PT: Flash Microcontrollers; MPN: PIC18F8722-E/PT; OC_FARNELL: 1579613; OC_NEWARK: 56K7314; PACKAGE: QFP-80; SUPPLIER: Microchip
U$5 U$6 = BME280:BME280